# EAGLE design 2xLED_Panel (EAGLE 9.6.2)
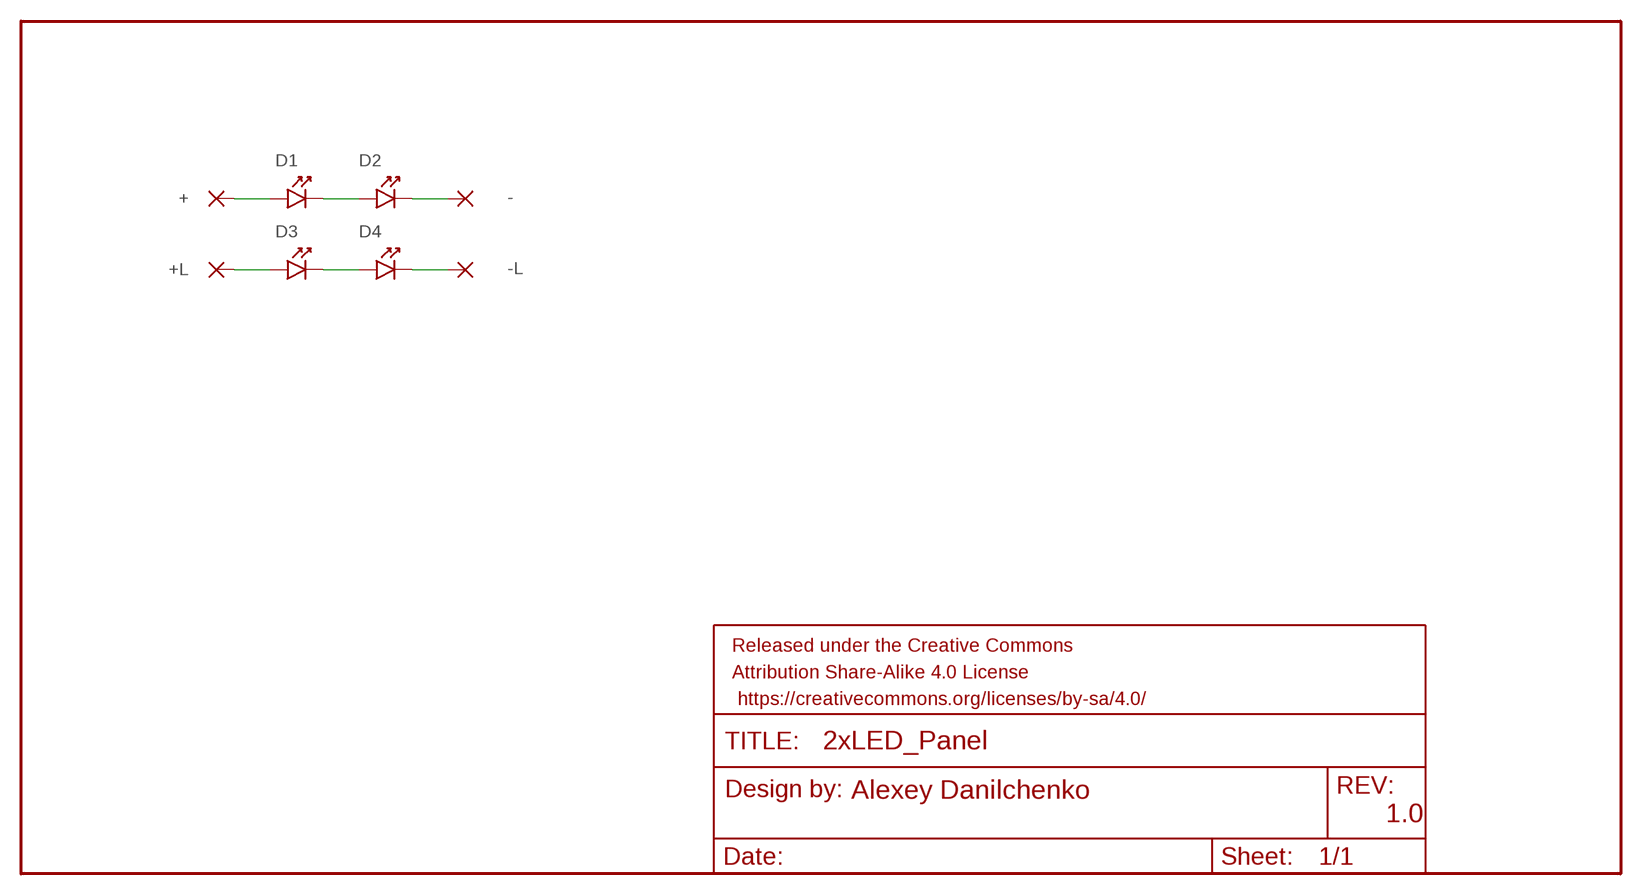
[diagram p0: schematic, sheet 1]

## Parts
+  2,15/1,0  [2,15/1,0]
+L  2,15/1,0  [2,15/1,0]
-  2,15/1,0  [2,15/1,0]
-L  2,15/1,0  [2,15/1,0]
D1  YUJI_2835_SMD  [2835_SMD]
D2  YUJI_2835_SMD  [2835_SMD]
D3  YUJI_2835_SMD  [2835_SMD]
D4  YUJI_2835_SMD  [2835_SMD]
FRAME1  FRAME-LEDGER  [CREATIVE_COMMONS]

## Nets
N$1: D1.CATHODE D2.ANODE
N$2: +.1(P) D1.ANODE
N$3: -.1(P) D2.CATHODE
N$4: D3.CATHODE D4.ANODE
N$5: +L.1(P) D3.ANODE
N$6: -L.1(P) D4.CATHODE

## Library data of the parts
+ +L - -L = wirepad:2,15/1,0: THROUGH-HOLE PAD
D1-D4 = Yuji_LED:YUJI_2835_SMD
FRAME1 = SparkFun-Aesthetics:FRAME-LEDGER: Schematic Frame Standard 11x14 US Ledger frame; AUTHOR: Alexey Danilchenko; VER: 1.0

## Board
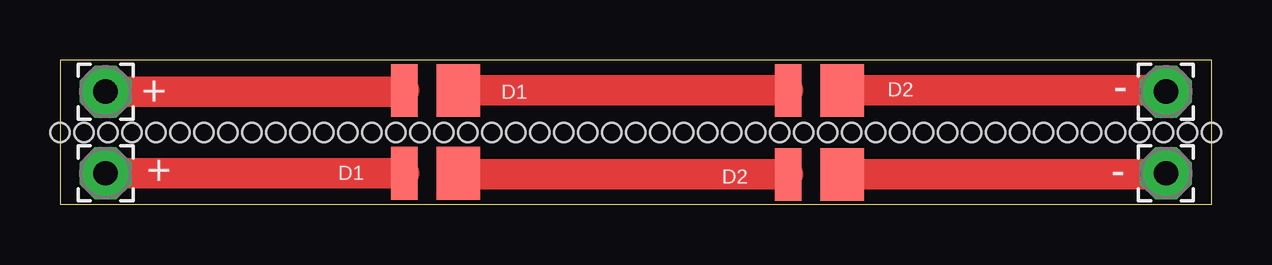
[diagram p1: board, top side]

Size 48 x 6 mm. Coordinates in mm from the lower left corner, seen from the top.
Outline: 0,0 48,0 48,6 0,6 0,0
Copper layers (1*16): Top 0.035mm / dielectric 1.5mm / Bottom 0.035mm
Design rules "default": minimum track width 10mil, minimum drill 24mil, track to track 8mil, track to pad 8mil, pad to pad 8mil, via to via 8mil, smd to smd 8mil, copper to edge 40mil, drill to drill 8mil, minimum pad ring 10mil, minimum via ring 8mil, stop-mask expansion 4mil, vias tented up to drill 0mil, thermal gap 10mil
Holes 0.8 mm at 0,3 1,3 2,3 3,3 4,3 5,3 6,3 7,3 8,3 9,3 10,3 11,3 12,3 13,3 14,3 15,3 16,3 17,3 18,3 19,3 20,3 21,3 22,3 23,3 24,3 25,3 26,3 27,3 28,3 29,3 30,3 31,3 32,3 33,3 34,3 36,3 35,3 37,3 38,3 39,3 40,3 41,3 42,3 43,3 44,3 45,3 46,3 47,3 48,3

### Footprints (pad centres in the part's own frame; a part is rotated, then mirrored left to right if it is on the bottom)
2,15/1,0 = drill 1.016 pad 2.159 octagon: 1 0,0
2835_SMD = smd 1.1 x 2.2: ANODE 0.95,0 | smd 1.8 x 2.2: CATHODE -1.3,0

### Placement (x,y rotation side)
+  1.9,1.3 270 top
+L  1.9,4.7 0 top
-  46.1,1.3 90 top
-L  46.1,4.7 0 top
D1  15.3,1.3 180 top
D2  31.3,1.25 180 top
D3  15.3,4.75 180 top
D4  31.3,4.75 180 top
FRAME1  0,0 0 top

### Tracks (layer width: path | path; a pad name or v marks a point on that pad's centre or on a via)
N$1
  Top 1.27: D2.ANODE 17.47,1.25 D1.CATHODE
N$2
  Top 1.27: D1.ANODE +.1
N$3
  Top 1.27: D2.CATHODE 46.05,1.25 -.1
N$4
  Top 1.27: D3.CATHODE D4.ANODE
N$5
  Top 1.27: +L.1 13.95,4.7 D3.ANODE
N$6
  Top 1.27: D4.CATHODE 46.05,4.75 -L.1

### Text on the board
tNames: + | D1 | D2 | -
bNames: - LED | LED + | - LED